# Altium schematic sheet serial.SchDoc
size A4
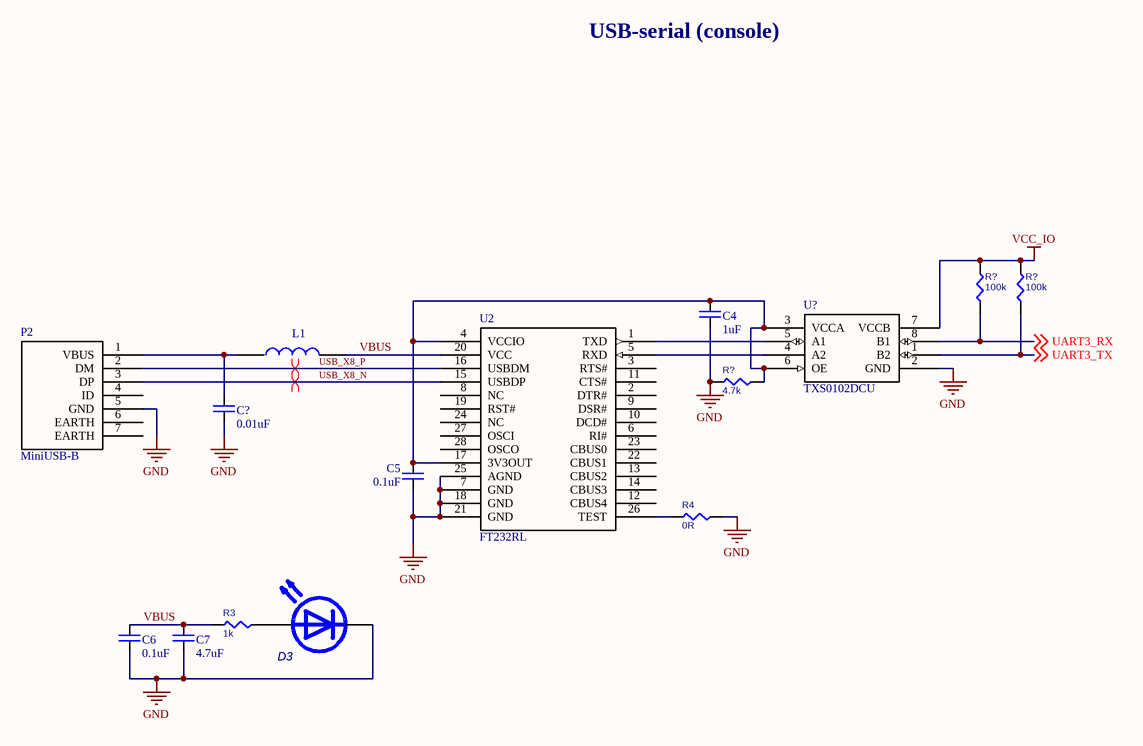
[diagram p0: serial.SchDoc]

## Parts
(Parts that share a designator on the sheet are numbered #1, #2 ... from top to bottom, then left to right.)
C4  value 1uF  [CHIP0603]  (hidden comment: C0603)
C5  value 0.1uF  [CHIP0603]  (hidden comment: C0603)
C6  value 0.1uF  [CHIP0603]  (hidden comment: C0603)
C7  value 4.7uF  [CHIP0603]  (hidden comment: C0603)
C?  value 0.01uF  [CHIP0603]  (hidden comment: C0603)
D3  LED0805  [LED0805]  (value not drawn)
L1  BLM18A-FB  [CHIP0603]  (value not drawn)
P2  MiniUSB-B  [MINI-USB-B5 SMT]
R3  value 1k  [CHIP0603]  (hidden comment: R0603)
R4  value 0R  [CHIP0603]  (hidden comment: R0603)
R?#1  value 100k  [CHIP0603]  (hidden comment: R0603)
R?#2  value 100k  [CHIP0603]  (hidden comment: R0603)
R?#3  value 4.7k  [CHIP0603]  (hidden comment: R0603)
U2  FT232RL  [SOP65P780X200-28N]
U?  TXS0102DCU  [PDSO8_DCU]

## Nets
GND: C4.1 C5.1 C6.1 C7.1 C?.2 D3.2(C) P2.5(GND) R4.1 R?#3.1 U2.7(GND) U2.18(GND) U2.21(GND) U2.25(AGND) U?.2(GND)
VCC_IO: R?#1.2 R?#2.2 U?.7(VCCB)
UART3_RX: R?#1.1 U?.8(B1) ; off-sheet UART3_RX
UART3_TX: R?#2.1 U?.1(B2) ; off-sheet UART3_TX
USB_X8_N: P2.3(DP) U2.15(USBDP)
USB_X8_P: P2.2(DM) U2.16(USBDM)
VBUS: C6.2 C7.2 L1.2 R3.2 U2.20(VCC)
NetC4_2: C4.2 C5.2 R?#3.2 U2.4(VCCIO) U2.17(3V3OUT) U?.3(VCCA) U?.6(OE)
NetC?_1: C?.1 L1.1 P2.1(VBUS)
NetD3_1: D3.1(A) R3.1
NetR4_2: R4.2 U2.26(TEST)
NetU2_1: U2.1(TXD) U?.5(A1)
NetU2_5: U2.5(RXD) U?.4(A2)

Not connected (* = marked no-connect by the designer): P2 4(ID) 6(EARTH) 7(EARTH); U2 2(DTR#) 3(RTS#) 6(RI#) 8(NC) 9(DSR#) 10(DCD#) 11(CTS#) 12(CBUS4) 13(CBUS2) 14(CBUS3) 19(RST#) 22(CBUS1) 23(CBUS0) 24(NC) 27(OSCI) 28(OSCO)

## Layout directives
differential pair: USB_X8_N, USB_X8_P

## Notes on the sheet
- USB-serial (console)

## Library data of the parts
C4-C7 C? = C0603: Ceramic capacitor C0603
D3 = LED0805: LED 0805; Value: *
L1 = BLM18A-FB: Chip EMIFILr Inductor Type; Manufacturer: Murata; Man P/N: BLM18AG601SN1D
P2 = MiniUSB-B: Mini USB Type B CONNECTOR
R3 R4 R?#1-R?#3 = R0603: Resistor 0603
U2 = FT232RL: Single chip USB to USART transfer interface.; Manufacturer: FTDI; Man P/N: FT232RL; Package: 28 Pin SSOP
U? = TXS0102DCU: 2bit Bidirectional voltage translator; Manufacturer: TI; Package: DCU; Man P/N: TXS0102DCU